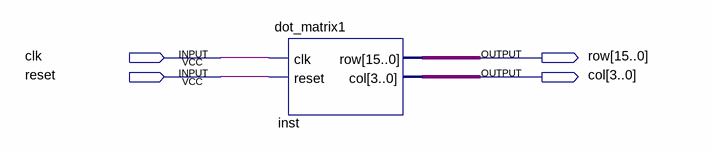
[diagram p0: schematic sheet]
// Quartus schematic 1616.bdf as structural Verilog: 1 symbols, 4 pins
module \1616  (
  input  clk,
  input  reset,
  output [15:0] row,
  output [3:0] col
);

  dot_matrix1 inst (.clk(clk), .reset(reset), .row(row), .col(col));
endmodule
